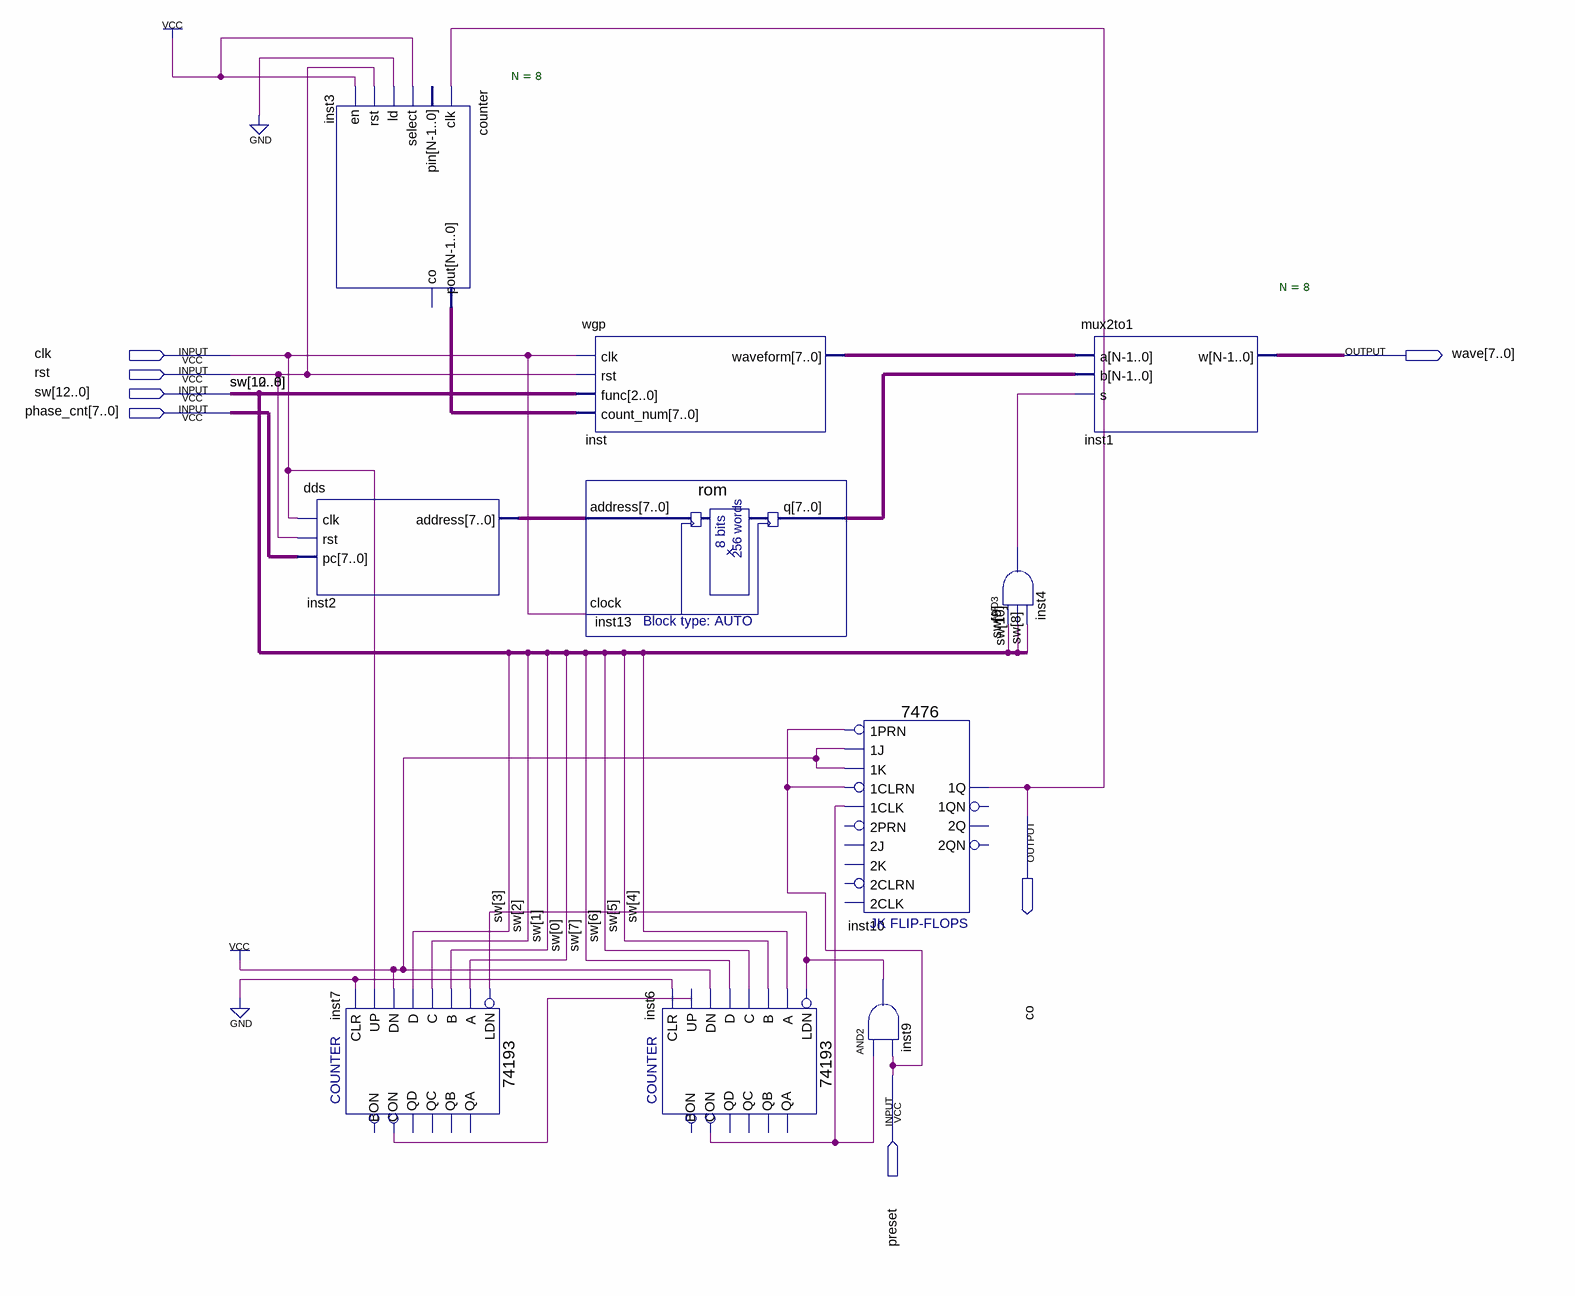
[diagram p0: schematic sheet]
// Quartus schematic fs.bdf as structural Verilog: 10 symbols, 7 pins
module fs (
  input  clk,
  input  rst,
  input  [12:0] sw,
  input  [7:0] phase_cnt,
  input  preset,
  output [7:0] wave,
  output co
);

  wire inst4_out, inst6_con, inst7_con, inst9_out;
  wire [7:0] inst2_address, inst3_pout, inst13_q, inst_waveform;

  counter #(.N(8)) inst3 (
    .clk(co), .select(1'b1), .ld(1'b0), .rst(rst), .en(1'b1), .pout(inst3_pout));  // open: pin, co
  dds inst2 (.clk(clk), .rst(rst), .pc(phase_cnt), .address(inst2_address));
  \74193  inst7 (
    .D(sw[3]), .C(sw[2]), .B(sw[1]), .A(sw[0]), .CLR(1'b0), .UP(clk), .DN(1'b1), .LDN(inst9_out),
    .CON(inst7_con));  // open: QB, QA, QD, QC, BON
  wgp inst (.clk(clk), .rst(rst), .func(sw[10:8]), .count_num(inst3_pout), .waveform(inst_waveform));
  rom inst13 (.address(inst2_address), .clock(clk), .q(inst13_q));
  \74193  inst6 (
    .D(sw[7]), .C(sw[6]), .B(sw[5]), .A(sw[4]), .CLR(1'b0), .UP(inst7_con), .DN(1'b1), .LDN(inst9_out),
    .CON(inst6_con));  // open: QB, QA, QD, QC, BON
  \7476  inst10 (
    .\1J (1'b1), .\1K (1'b1), .\1PRN (preset), .\1CLK (inst6_con), .\1CLRN (preset), .\1Q (co));  // open: 2PRN, 2J, 2K, 2CLRN, 2CLK, 2QN, 2Q, 1QN
  and inst9 (inst9_out, inst6_con, preset);
  and inst4 (inst4_out, sw[9], sw[10], sw[8]);
  mux2to1 #(.N(8)) inst1 (.a(inst_waveform), .b(inst13_q), .s(inst4_out), .w(wave));
endmodule
